# EAGLE design AdapterDIP8M16 (EAGLE 6.3)
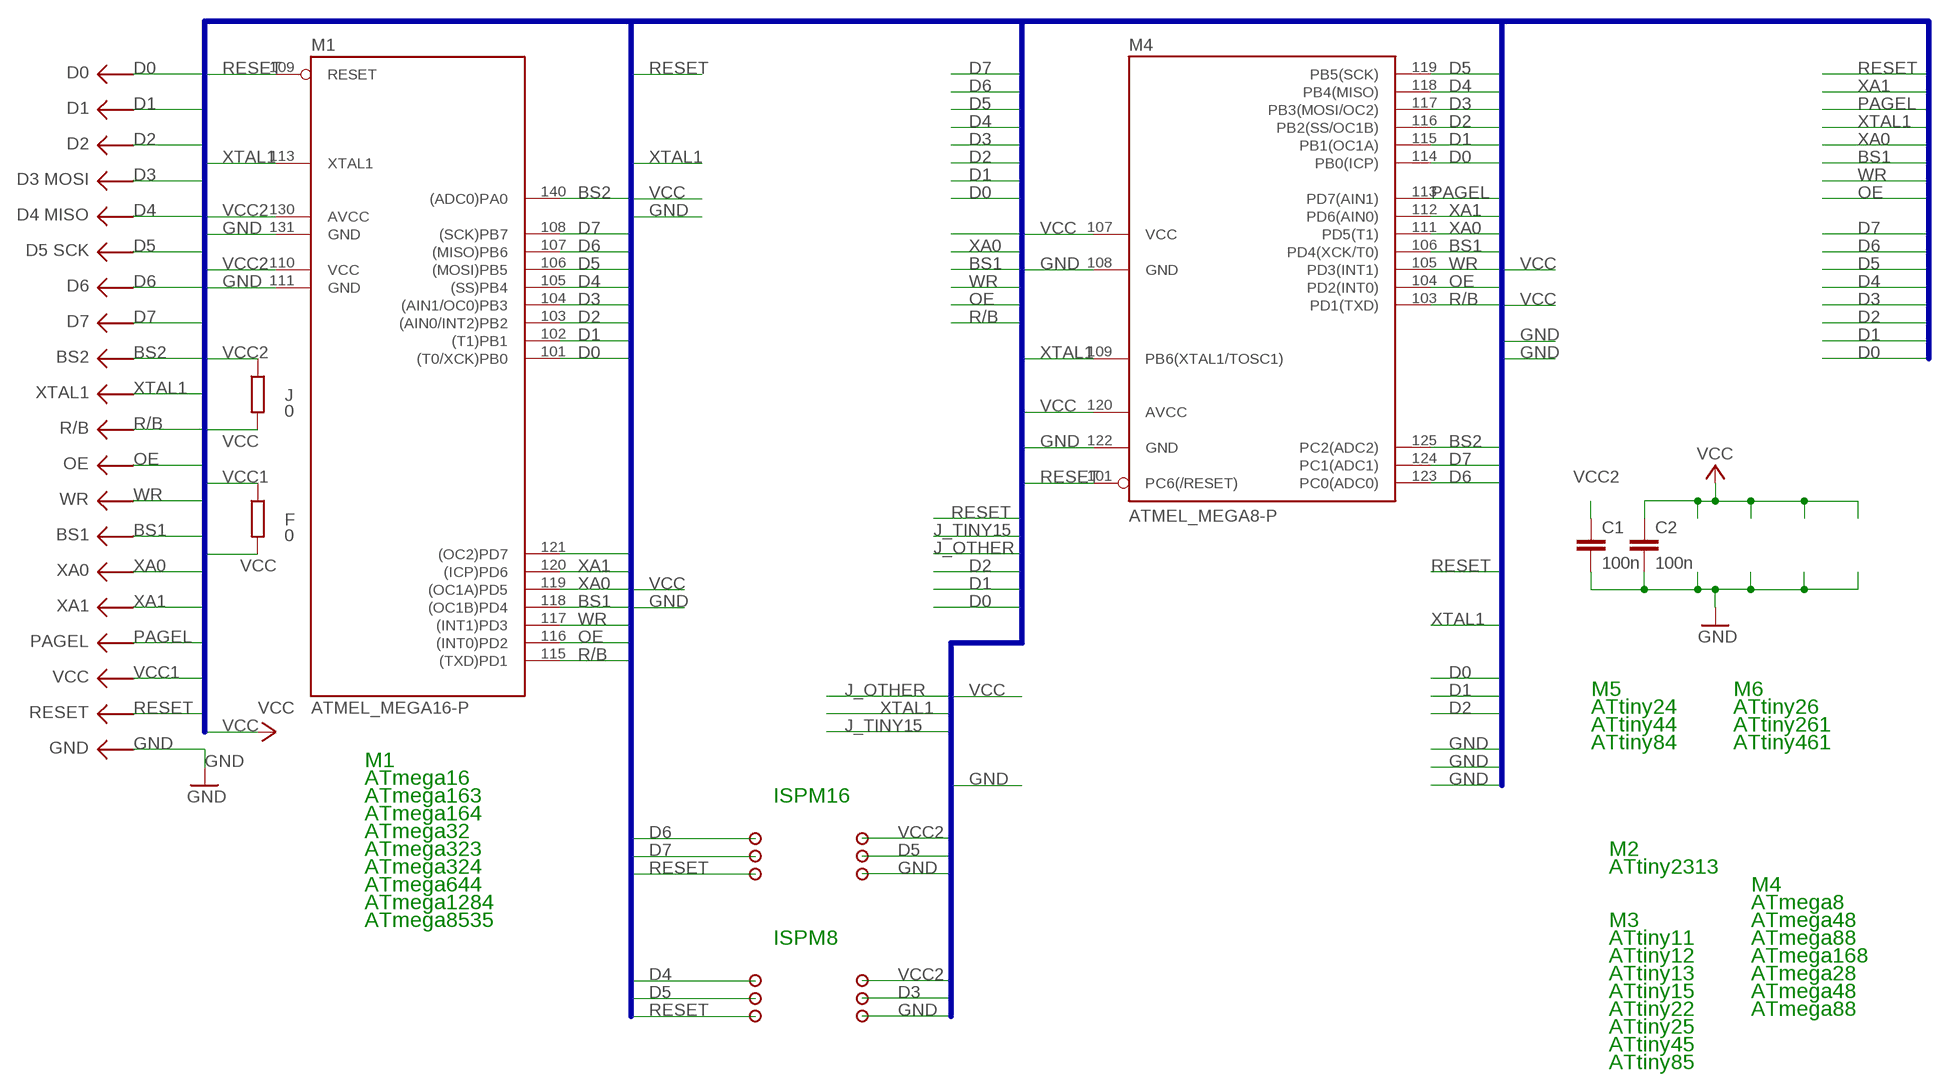
[diagram p0: schematic, sheet 1]

## Parts
C1  100n  RCL_C-EUC0805  [RCL_C0805]
C2  100n  RCL_C-EUC0805  [RCL_C0805]
F  0  RCL_R-EU_M0805  [RCL_M0805]
J  0  RCL_R-EU_M1206  [RCL_M1206]
M1  ATMEL_MEGA16-P  [ATMEL_DIL40]
M4  ATMEL_MEGA8-P  [ATMEL_DIL28-3]
U$1  PROGRAMMER_P_AVR  [PROGRAMMER_P_AVR]
U$2  PIN  [PIN]
U$3  PIN  [PIN]
U$4  PIN  [PIN]
U$5  PIN  [PIN]
U$6  PIN  [PIN]
U$7  PIN  [PIN]
U$8  PIN  [PIN]
U$9  PIN  [PIN]
U$10  PIN  [PIN]
U$11  PIN  [PIN]
U$12  PIN  [PIN]
U$13  PIN  [PIN]

## Nets
BS1: M1.118((OC1B)PD4) M4.106(PD4(XCK/T0)) U$1.BS1
BS2: M1.140((ADC0)PA0) M4.125(PC2(ADC2)) U$1.BS2
D0: M1.101((T0/XCK)PB0) M4.114(PB0(ICP)) U$1.D0
D1: M1.102((T1)PB1) M4.115(PB1(OC1A)) U$1.D1
D2: M1.103((AIN0/INT2)PB2) M4.116(PB2(SS/OC1B)) U$1.D2
D3: M1.104((AIN1/OC0)PB3) M4.117(PB3(MOSI/OC2)) U$1.D3 U$12.P$1
D4: M1.105((SS)PB4) M4.118(PB4(MISO)) U$1.D4 U$8.P$1
D5: M1.106((MOSI)PB5) M4.119(PB5(SCK)) U$1.D5 U$3.P$1 U$9.P$1
D6: M1.107((MISO)PB6) M4.123(PC0(ADC0)) U$1.D6 U$5.P$1
D7: M1.108((SCK)PB7) M4.124(PC1(ADC1)) U$1.D7 U$6.P$1
GND: C1.2 C2.2 M1.111(GND) M1.131(GND) M4.108(GND) M4.122(GND) U$1.GND U$1.GND01(GND) U$1.GND2(GND) U$1.GND03(GND) U$1.GND04(GND) U$1.GND05(GND) U$1.GND06(GND) U$1.GND07(GND) U$1.GND08(GND) U$1.GND09(GND) U$1.GND10(GND) U$1.GND11(GND) U$1.GND12(GND) U$1.GND13(GND) U$1.GND14(GND) U$1.GND15(GND) U$1.GND16(GND) U$1.GND17(GND) U$1.GND18(GND) U$1.GND19(GND) U$1.GND20(GND) U$1.GND21(GND) U$1.GND22(GND) U$4.P$1 U$11.P$1
OE: M1.116((INT0)PD2) M4.104(PD2(INT0)) U$1.OE
PAGEL: M1.121((OC2)PD7) M4.113(PD7(AIN1)) U$1.PAGEL
R/B: M1.115((TXD)PD1) M4.103(PD1(TXD)) U$1.RB
RESET: M1.109(RESET) M4.101(PC6(/RESET)) U$1.RESET U$7.P$1 U$10.P$1
VCC: C2.1 F.2 J.2 M4.107(VCC) M4.120(AVCC)
VCC1: F.1 U$1.VCC
VCC2: C1.1 J.1 M1.110(VCC) M1.130(AVCC) U$2.P$1 U$13.P$1
WR: M1.117((INT1)PD3) M4.105(PD3(INT1)) U$1.WR
XA0: M1.119((OC1A)PD5) M4.111(PD5(T1)) U$1.XA0
XA1: M1.120((ICP)PD6) M4.112(PD6(AIN0)) U$1.XA1
XTAL1: M1.113(XTAL1) M4.109(PB6(XTAL1/TOSC1)) U$1.XTAL1

## Buses
D[0..7],BS1,BS2,XTAL1,R/B,OE,WR,XA0,XA1,PAGEL,RESET,VCC,GND,J_OTHER,J_TINY15,VCC1,VCC2

## Notes on the sheet
- M5 | M6
- ATtiny24 | ATtiny26
- ATtiny44 | ATtiny261
- ATtiny84 | ATtiny461
- M1
- ATmega16
- ATmega163 | ISPM16
- ATmega164
- ATmega32
- ATmega323 | M2
- ATmega324 | ATtiny2313
- ATmega644 | M4
- ATmega1284 | ATmega8
- ATmega8535 | M3 | ATmega48
- ISPM8 | ATtiny11 | ATmega88
- ATtiny12 | ATmega168
- ATtiny13 | ATmega28
- ATtiny15 | ATmega48
- ATtiny22 | ATmega88
- ATtiny25
- ATtiny45
- ATtiny85

## Library data of the parts
C1 C2 = HWProgUSB:RCL_C-EU: CAPACITOR, European symbol
F J = HWProgUSB:RCL_R-EU_: RESISTOR, European symbol
M1 = AdapterDIP8M16:ATMEL_MEGA16-P: MICROCONTROLLER 16 Kbytes FLASH 1 kbytes SRAM 512 bytes EEPROM USART 8-channel 10 bit ADC Source: avr.lbr
M4 = AdapterDIP8M16:ATMEL_MEGA8-P: MICROCONTROLLER 8 Kbytes FLASH, 1 kbytes SRAM, 512 bytes EEPROM, USART, 4-channel 10 bit ADC, 2-channel 8 bit ADC Pin compatible with Atmega48, ATMega88, ATMega168 Source: avr.lbr
U$1 = AdapterDIP_P:PROGRAMMER_P_AVR
U$2-U$13 = AdapterDIP8M16:PIN

## Board
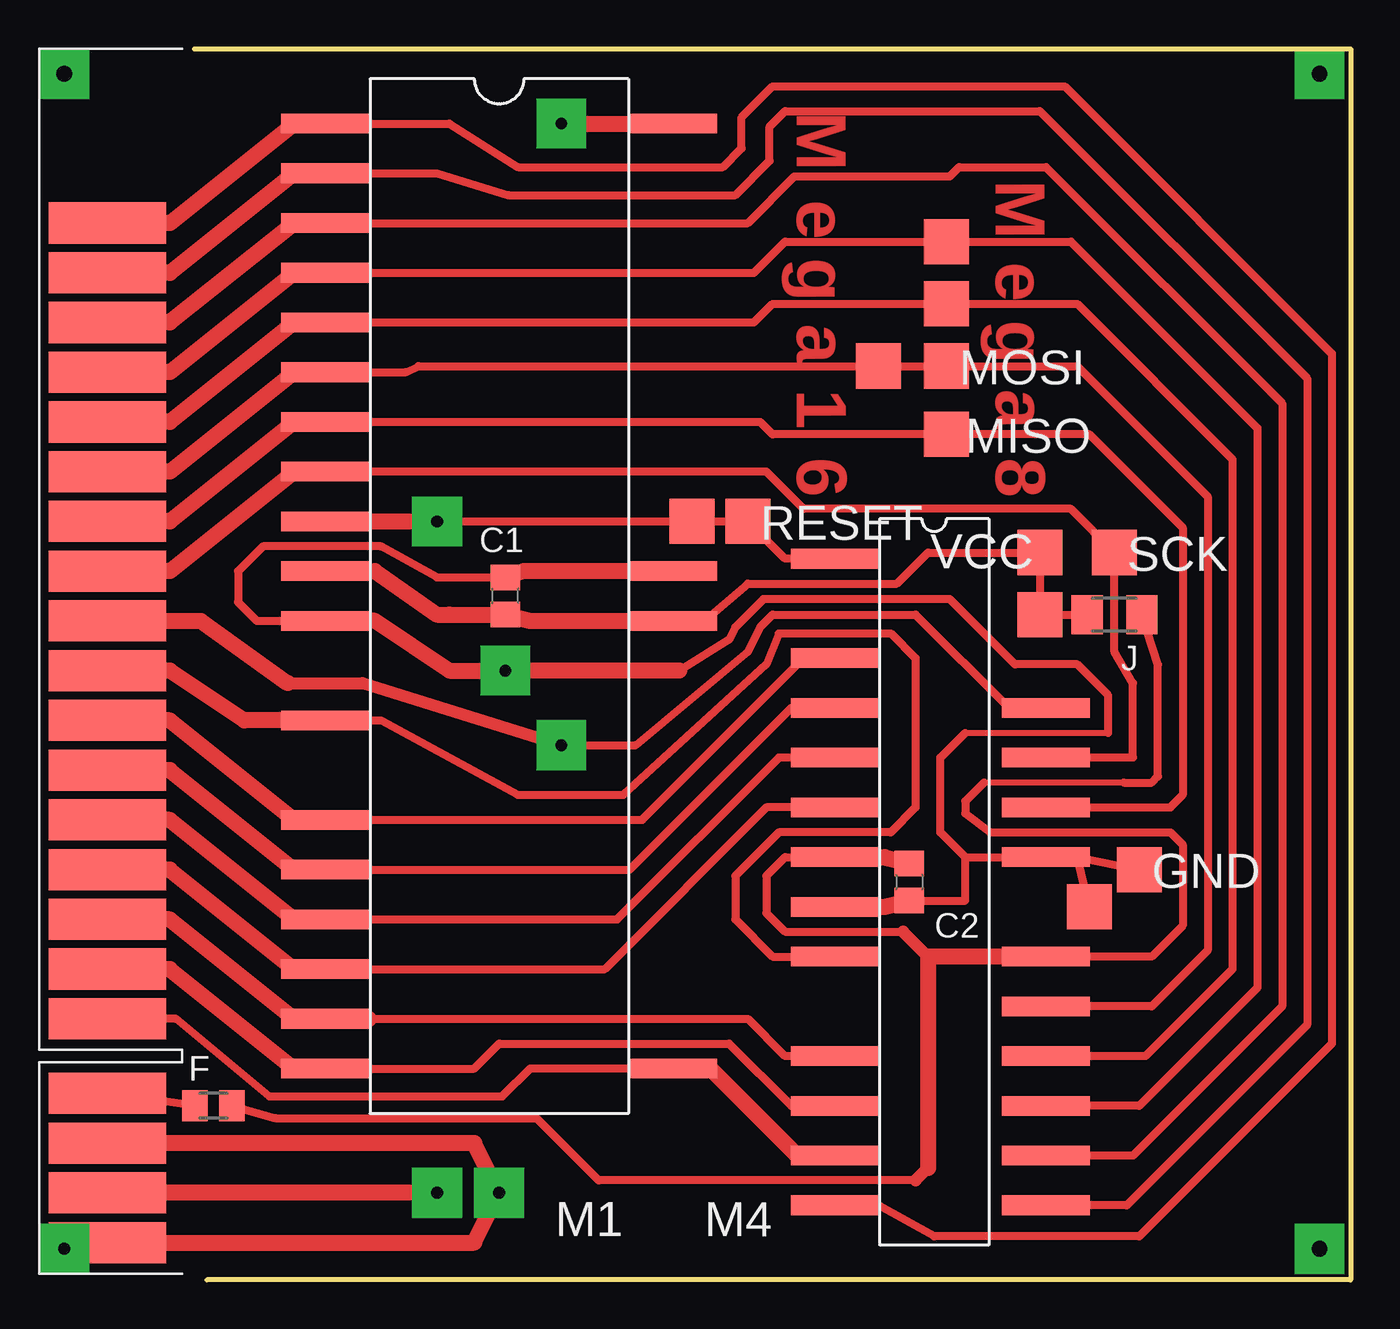
[diagram p1: board, top side]
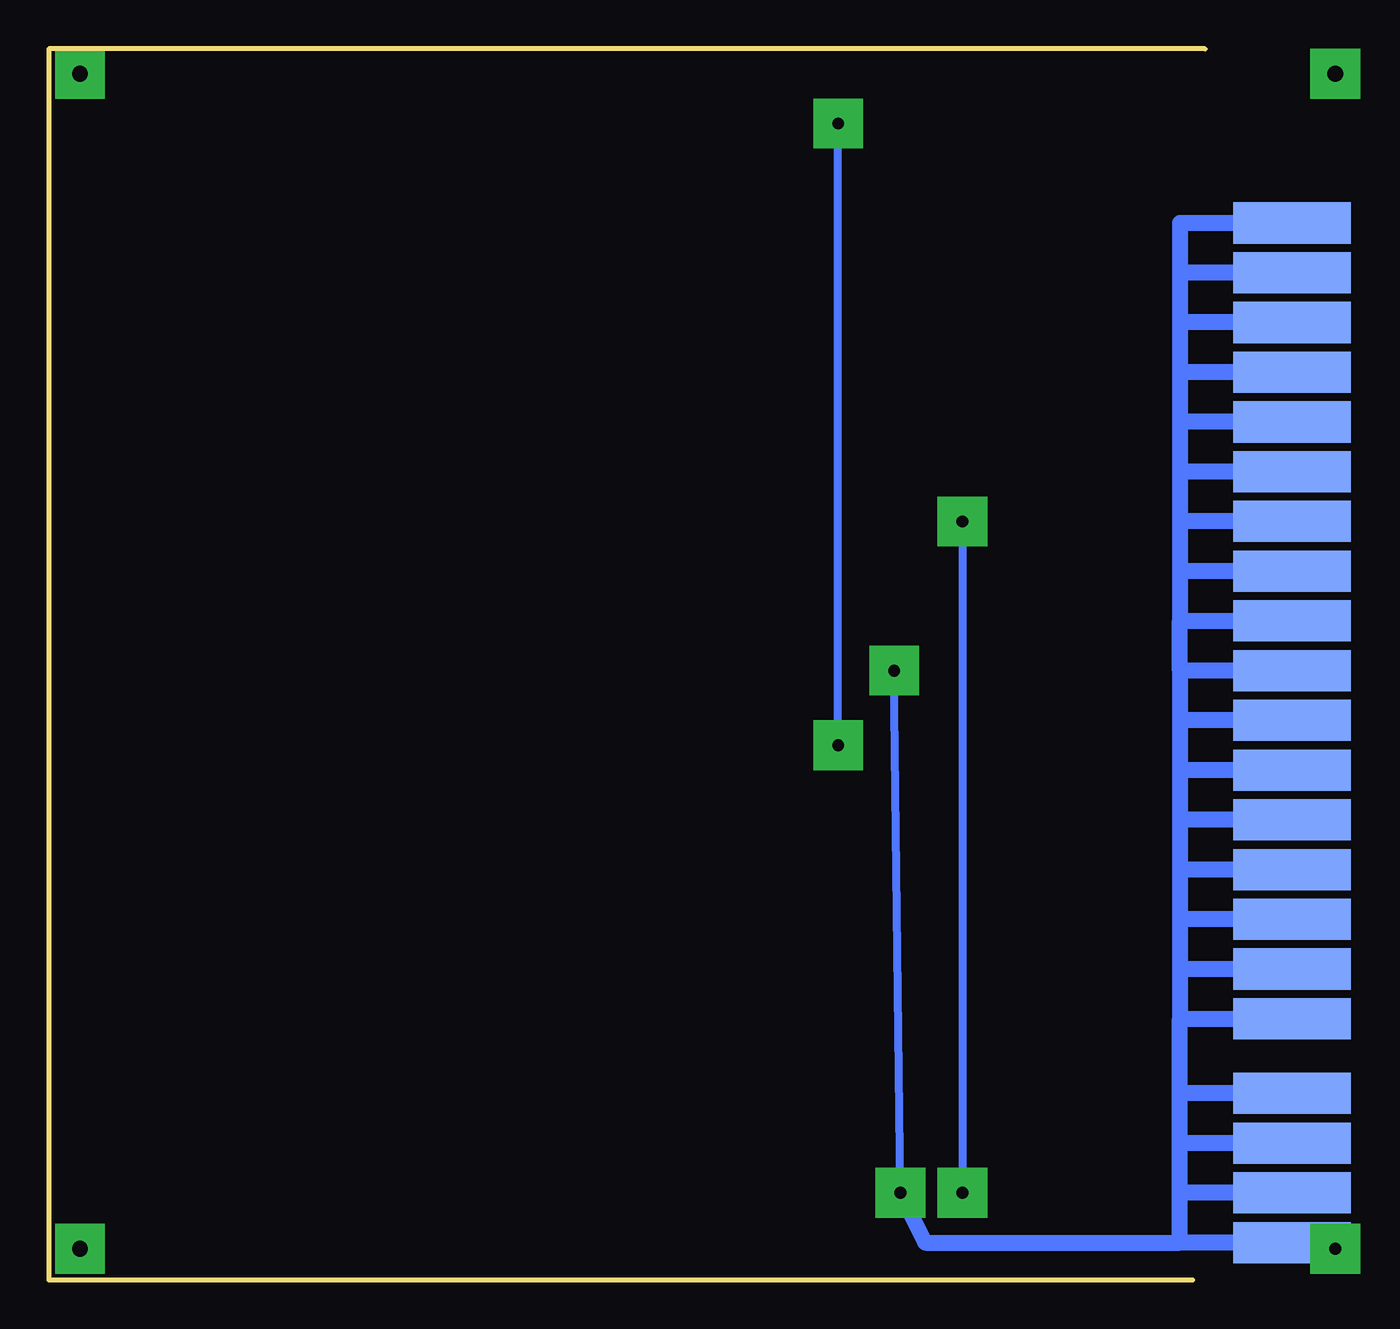
[diagram p2: board, bottom side, seen from below]

Size 59.05 x 62.86 mm. Coordinates in mm from the lower left corner, seen from the top.
Outline: 0,62.86 59.05,62.86 59.05,0 0.63,0
Copper layers (1*16): Top 0.035mm / dielectric 1.5mm / Bottom 0.035mm
Design rules "DesignRules": minimum track width 8mil, minimum drill 24mil, track to track 0.2mm, track to pad 0.2mm, pad to pad 8mil, via to via 8mil, smd to smd 8mil, copper to edge 10mil, drill to drill 8mil, minimum pad ring 0.65mm, minimum via ring 8mil, stop-mask expansion 4mil, vias tented up to drill 0mil, thermal gap 10mil

### Footprints (pad centres in the part's own frame; a part is rotated, then mirrored left to right if it is on the bottom)
RCL_C0805 = smd 1.3 x 1.5: 1 -0.95,0; 2 0.95,0
RCL_M0805 = smd 1.3 x 1.6: 1 -0.95,0; 2 0.95,0
RCL_M1206 = smd 1.6 x 2: 1 -1.4,0; 2 1.4,0
ATMEL_DIL40 = smd 1 x 4.5: 101 -24.13,-8.89; 102 -21.59,-8.89; 103 -19.05,-8.89; 104 -16.51,-8.89; 105 -13.97,-8.89; 106 -11.43,-8.89; 107 -8.89,-8.89; 108 -6.35,-8.89; 109 -3.81,-8.89; 110 -1.27,-8.89; 111 1.27,-8.89; 113 6.35,-8.89; 115 11.43,-8.89; 116 13.97,-8.89; 117 16.51,-8.89; 118 19.05,-8.89; 119 21.59,-8.89; 120 24.13,-8.89; 121 24.13,8.89; 130 1.27,8.89; 131 -1.27,8.89; 140 -24.13,8.89
ATMEL_DIL28-3 = smd 1 x 4.5: 101 -16.51,-5.08; 103 -11.43,-5.08; 104 -8.89,-5.08; 105 -6.35,-5.08; 106 -3.81,-5.08; 107 -1.27,-5.08; 108 1.27,-5.08; 109 3.81,-5.08; 111 8.89,-5.08; 112 11.43,-5.08; 113 13.97,-5.08; 114 16.51,-5.08; 115 16.51,5.715; 116 13.97,5.715; 117 11.43,5.715; 118 8.89,5.715; 119 6.35,5.715; 120 3.81,5.715; 122 -1.27,5.715; 123 -3.81,5.715; 124 -6.35,5.715; 125 -8.89,5.715
PROGRAMMER_P_AVR = smd 2.1 x 6: BS1 37.782,-0.318; BS2 25.082,-0.318; D0 4.763,-0.318; D1 7.303,-0.318; D2 9.842,-0.318; D3 12.383,-0.318; D4 14.922,-0.318; D5 17.462,-0.318; D6 20.003,-0.318; D7 22.543,-0.318; GND 51.752,-0.318; GND2 56.833,-0.318; OE 32.703,-0.318; PAGEL 45.403,-0.318; RB 30.163,-0.318; RESET 54.292,-0.318; VCC 49.212,-0.318; WR 35.242,-0.318; XA0 40.322,-0.318; XA1 42.862,-0.318; XTAL1 27.622,-0.318 | smd 2.1 x 6 bottom: GND01 4.763,-0.318; GND03 7.303,-0.318; GND04 9.842,-0.318; GND05 12.383,-0.318; GND06 14.922,-0.318; GND07 17.462,-0.318; GND08 20.003,-0.318; GND09 22.543,-0.318; GND10 25.082,-0.318; GND11 27.622,-0.318; GND12 30.163,-0.318; GND13 32.703,-0.318; GND14 35.242,-0.318; GND15 37.782,-0.318; GND16 40.322,-0.318; GND17 42.862,-0.318; GND18 45.403,-0.318; GND19 49.212,-0.318; GND20 51.752,-0.318; GND21 54.292,-0.318; GND22 56.833,-0.318
PIN = smd 2.3 x 2.3: P$1 0,0

### Placement (x,y rotation side)
C1  15.88,34.92 90 top
C2  36.51,20.32 270 top
F  0.95,8.89 0 top
J  46.99,33.97 0 top
M1  15.56,34.92 270 top
M4  37.78,20.32 270 top
U$1  -4.13,58.74 270 top  (outside the outline)
U$2  43.18,37.15 0 top
U$3  38.42,46.67 0 top
U$4  48.26,20.96 0 top
U$5  38.42,43.18 0 top
U$6  46.99,37.15 0 top
U$7  28.26,38.73 0 top
U$8  38.42,49.85 0 top
U$9  34.93,46.67 0 top
U$10  25.4,38.73 0 top
U$11  45.72,19.05 0 top
U$12  38.42,53.02 0 top
U$13  43.18,33.97 0 top

### Tracks (layer width: path | path; a pad name or v marks a point on that pad's centre or on a via)
BS1
  Top 0.406: M4.106 29.21,24.13 20.95,15.87 7.94,15.87
  Top 0.813: 7.94,15.87 M1.118 5.08,15.87 -1.27,20.96 U$1.BS1
BS2  (via drill 0.6 pad 2.54)
  Top 0.406: v18.73,27.3 22.54,27.3 28.26,32.07 28.89,33.34 29.53,33.97 36.83,33.97 41.59,29.21 M4.125
  Top 0.61: 4.76,30.48 8.57,30.48 v18.73,27.3
  Top 0.813: U$1.BS2 0.32,33.65 4.76,30.48 | v18.73,59.06 M1.140
  Bottom 0.406: v18.73,27.3 v18.73,59.06
D0
  Top 0.406: M1.101 13.02,59.06 16.51,56.83 26.99,56.83 27.94,57.78 27.94,59.37 29.53,60.96 44.45,60.96 58.1,47.31 58.1,12.07 48.26,2.22 37.78,2.22 34.93,3.81 34.61,3.81 33.97,3.81 M4.114
  Top 0.813: M1.101 5.08,59.06 -1.27,53.97 U$1.D0
D1
  Top 0.406: M4.115 47.62,3.81 56.83,13.02 56.83,46.04 43.18,59.69 30.16,59.69 29.37,58.9 29.37,57.15 27.62,55.4 16.03,55.4 12.38,56.52 M1.102
  Top 0.813: M1.102 5.08,56.52 -1.27,51.43 U$1.D1 -5.08,51.43
D2
  Top 0.406: M4.116 47.94,6.35 55.56,13.97 55.56,44.77 43.5,56.83 39.05,56.83 38.58,56.36 30.64,56.36 28.26,53.97 7.94,53.97
  Top 0.813: 7.94,53.97 M1.103 5.08,53.97 -1.27,48.89 U$1.D2
D3
  Top 0.406: M4.117 48.26,8.89 54.29,14.92 54.29,43.5 44.77,53.02 U$12.P$1 30.16,53.02 28.58,51.43 M1.104
  Top 0.813: M1.104 5.08,51.43 -1.27,46.35 U$1.D3
D4
  Top 0.406: M4.118 48.58,11.43 53.02,15.87 53.02,41.91 45.08,49.85 U$8.P$1 29.53,49.85 28.58,48.89 M1.105
  Top 0.813: M1.105 5.08,48.89 -1.27,43.82 U$1.D4
D5
  Top 0.406: M4.119 48.9,13.97 51.75,16.83 51.75,40 45.08,46.67 U$3.P$1 U$9.P$1 11.43,46.67 10.79,46.35 7.94,46.35
  Top 0.813: -5.08,41.28 U$1.D5 -1.27,41.28 5.08,46.35 M1.106 7.94,46.35
D6
  Top 0.406: M4.123 49.85,24.13 50.48,24.76 50.48,38.42 45.72,43.18 U$5.P$1 29.53,43.18 28.89,43.82 M1.107
  Top 0.813: M1.107 5.08,43.82 -1.27,38.74 U$1.D6
D7
  Top 0.406: M4.124 47.94,26.67 47.94,30.48 46.99,32.07 U$6.P$1 44.77,39.37 31.12,39.37 29.21,41.28 7.62,41.28
  Top 0.813: 8.26,41.28 7.62,41.28 M1.108 5.08,41.28 -1.27,36.2 U$1.D7
GND  (via drill 0.6 pad 2.54)
  Top 0.305: 39.37,27.94 46.67,27.94
  Top 0.406: M4.122 45.08,21.59 | 39.37,27.94 38.1,26.67 38.1,22.86 39.37,21.59 | 46.67,27.94 46.67,29.85 45.08,31.43 41.91,31.43 38.58,34.77 29.05,34.77 27.62,33.34 27.3,32.7 24.76,31.12 | 7.94,33.65 3.18,33.65 2.22,34.61 2.22,36.2 3.49,37.46 9.53,37.46 12.38,35.88 C1.2 | C2.2 39.37,19.37 39.37,21.59 | 39.37,21.59 41.59,21.59 | U$11.P$1 45.08,21.59 | 45.08,21.59 U$4.P$1
  Top 0.813: M1.111 7.94,33.65 9.21,33.65 13.02,31.12 v15.88,31.12 24.76,31.12 | 23.18,36.2 M1.131 16.83,36.19 C1.2 | M4.108 33.97,19.05 35.24,19.05 C2.2 | 41.59,21.59 M4.122 | U$1.GND22 14.29,1.91 v15.56,4.45 14.29,6.99 U$1.GND
  Bottom 0.406: v15.56,4.45 v15.88,31.12
  Bottom 0.813: U$1.GND19 1.27,9.52 | 1.27,9.52 1.27,13.33 | 1.27,13.33 U$1.GND18 | U$1.GND22 1.27,1.91 | 1.27,1.91 1.27,4.45 | 1.27,4.45 1.27,6.99 | 1.27,6.99 1.27,9.52 | U$1.GND21 1.27,4.45 | U$1.GND 1.27,6.99 | U$1.GND17 1.27,15.87 | 1.27,15.87 1.27,13.33 | U$1.GND16 1.27,18.42 | 1.27,18.42 1.27,15.87 | U$1.GND15 1.27,20.96 | 1.27,20.96 1.27,18.42 | U$1.GND14 1.27,23.49 | 1.27,23.49 1.27,20.96 | U$1.GND13 1.27,26.03 | 1.27,26.03 1.27,23.49 | U$1.GND12 1.27,28.57 | 1.27,28.57 1.27,26.03 | U$1.GND11 1.27,31.12 | 1.27,31.12 1.27,28.57 | 1.27,31.12 1.27,33.65 | 1.27,33.65 U$1.GND10 | U$1.GND09 1.27,36.2 | 1.27,36.2 1.27,33.65 | U$1.GND08 1.27,38.74 | 1.27,38.74 1.27,36.2 | U$1.GND07 1.27,41.28 | 1.27,41.28 1.27,38.74 | U$1.GND06 1.27,43.82 | 1.27,43.82 1.27,41.28 | U$1.GND05 1.27,46.35 | 1.27,46.35 1.27,43.82 | U$1.GND04 1.27,48.89 | 1.27,48.89 1.27,46.35 | U$1.GND03 1.27,51.43 | 1.27,51.43 1.27,48.89 | U$1.GND01 1.27,53.97 1.27,51.43 | 1.27,1.91 14.29,1.91 v15.56,4.45
N$1  (via drill 0.8 pad 2.54)
  other vias: -6.67,61.59
N$2  (via drill 0.8 pad 2.54)
  other vias: 57.47,61.59
N$3  (via drill 0.8 pad 2.54)
  other vias: 57.47,1.59
N$4  (via drill 0.6 pad 2.54)
  other vias: -6.67,1.59
OE
  Top 0.406: 7.94,20.96 22.22,20.96 30.48,29.21 M4.104
  Top 0.813: U$1.OE -1.27,26.03 5.08,20.96 M1.116 7.94,20.96
PAGEL
  Top 0.406: M4.113 30.8,6.35 | U$1.PAGEL -0.95,13.33 3.81,9.37 15.72,9.37 17.15,10.8 23.18,10.8 | M1.121 26.35,10.8
  Top 0.813: 23.18,10.8 M1.121 | 26.35,10.8 30.8,6.35
R/B
  Top 0.406: 7.94,23.49 22.86,23.49 31.12,31.75 M4.103
  Top 0.813: U$1.RB -1.27,28.57 5.08,23.49 M1.115 7.94,23.49 | M4.103 33.97,31.75
RESET  (via drill 0.6 pad 2.54)
  Top 0.406: 33.97,36.83 30.16,36.83 U$7.P$1 U$10.P$1 v12.38,38.74
  Top 0.813: M1.109 v12.38,38.74 | M4.101 33.97,36.83 | v12.38,4.45 U$1.RESET
  Bottom 0.406: v12.38,38.74 v12.38,4.45
VCC
  Top 0.305: 47.47,25.4 40.32,25.4
  Top 0.406: 45.08,16.51 M4.120 48.9,16.51 50.48,18.1 50.48,22.23 49.85,22.86 40.64,22.86 39.37,23.81 39.37,24.45 40.32,25.4 | 36.83,5.08 20.64,5.08 17.46,8.25 4.13,8.25 F.2 | 36.19,17.78 30.16,17.78 29.21,18.73 29.21,20.64 30.16,21.59 33.97,21.59 | 47.47,25.4 48.9,25.4 49.21,25.72 49.21,31.43 J.2
  Top 0.61: 37.47,16.51 36.19,17.78 | 37.47,5.71 36.83,5.08
  Top 0.813: M4.107 33.97,21.59 35.24,21.59 C2.1 | M4.120 37.47,16.51 37.47,5.71
VCC1
  Top 0.406: F.1 U$1.VCC
VCC2
  Top 0.406: M1.130 26.04,33.65 28.26,35.56 35.88,35.56 37.47,37.15 U$2.P$1 U$13.P$1 J.1
  Top 0.813: M1.110 7.94,36.2 9.21,36.2 12.38,33.97 13.02,33.97 C1.1 17.15,33.65 M1.130
WR
  Top 0.406: M4.105 29.84,26.67 21.59,18.42 7.94,18.42
  Top 0.813: 7.94,18.42 M1.117 5.08,18.42 -1.27,23.49 U$1.WR
XA0
  Top 0.406: 7.94,13.33 28.26,13.33 30.16,11.43 M4.111
  Top 0.813: U$1.XA0 -1.27,18.42 5.08,13.33 M1.119 7.94,13.33 8.89,13.33
XA1
  Top 0.406: 7.94,10.8 14.29,10.8 15.56,12.07 27.3,12.07 30.48,8.89 M4.112
  Top 0.813: 7.94,10.8 M1.120 5.08,10.8 -1.27,15.87 U$1.XA1
XTAL1
  Top 0.406: 7.94,28.57 9.53,28.57 16.51,24.76 21.91,24.76 29.21,31.43 29.84,33.02 35.56,33.02 36.83,31.75 36.83,24.13 35.56,22.86 29.84,22.86 27.62,20.64 27.62,18.42 29.53,16.51 M4.109
  Top 0.813: 7.94,28.57 M1.113 2.54,28.57 -1.27,31.12 U$1.XTAL1

### Text on the board
Top: M | e | M | g | e | a | g | 1 | a | 6 | 8
tPlace: MOSI | MISO | RESET | VCC | SCK | GND